# EAGLE schematic alarm (EAGLE 6.2)
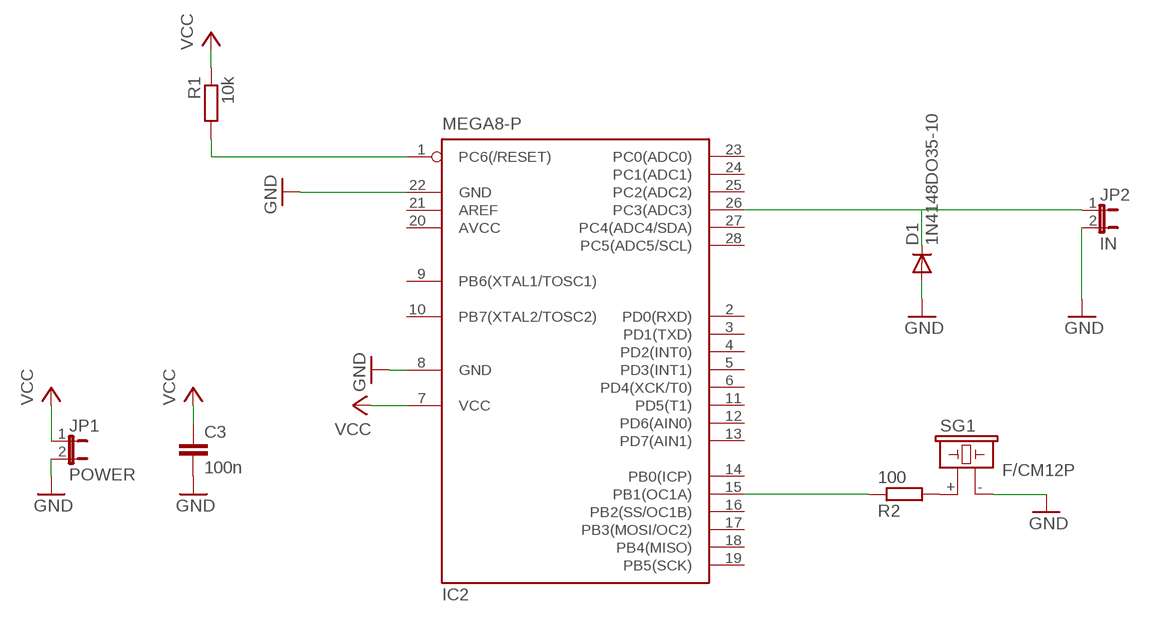
[diagram p0: schematic, sheet 1]

## Parts
C3  100n  C-EU025-024X044  [C025-024X044]
D1  1N4148DO35-10  [DO35-10]
IC2  MEGA8-P  [DIL28-3]
JP1  POWER  JP1E  [JP1]
JP2  IN  JP1E  [JP1]
R1  10k  R-EU_0207/15  [0207/15]
R2  100  R-EU_0207/10  [0207/10]
SG1  F/CM12P  [F/CM12P]

## Nets
GND: C3.2 D1.A IC2.8(GND) IC2.22(GND) JP1.2 JP2.2 SG1.-
N$1: R2.2 SG1.+
N$2: D1.C IC2.26(PC3(ADC3)) JP2.1
N$3: IC2.15(PB1(OC1A)) R2.1
N$17: IC2.1(PC6(/RESET)) R1.2
VCC: C3.1 IC2.7(VCC) JP1.1 R1.1
Unconnected: IC2.2(PD0(RXD)) IC2.3(PD1(TXD)) IC2.4(PD2(INT0)) IC2.5(PD3(INT1)) IC2.6(PD4(XCK/T0)) IC2.9(PB6(XTAL1/TOSC1)) IC2.10(PB7(XTAL2/TOSC2)) IC2.11(PD5(T1)) IC2.12(PD6(AIN0)) IC2.13(PD7(AIN1)) IC2.14(PB0(ICP)) IC2.16(PB2(SS/OC1B)) IC2.17(PB3(MOSI/OC2)) IC2.18(PB4(MISO)) IC2.19(PB5(SCK)) IC2.21(AREF) IC2.23(PC0(ADC0)) IC2.24(PC1(ADC1)) IC2.25(PC2(ADC2)) IC2.27(PC4(ADC4/SDA)) IC2.28(PC5(ADC5/SCL))

## Power pins joined to a net without a drawn wire
AVCC: IC2.20(AVCC)

## Library data of the parts
C3 = rcl:C-EU: CAPACITOR, European symbol
D1 = diode:1N4148: DIODE high speed (Philips)
IC2 = atmel:MEGA8-P: MICROCONTROLLER 8 Kbytes FLASH, 1 kbytes SRAM, 512 bytes EEPROM, USART, 4-channel 10 bit ADC, 2-channel 8 bit ADC Pin compatible with Atmega48, ATMega88, ATMega168 Source: avr.lbr
JP1 JP2 = jumper:JP1E: JUMPER
R1 R2 = rcl:R-EU_: RESISTOR, European symbol
SG1 = buzzer:F/CM12P: BUZZER Source: Buerklin; OC_FARNELL: unknown; OC_NEWARK: unknown